# EAGLE design ball_presence_pht (EAGLE 9.6.2)
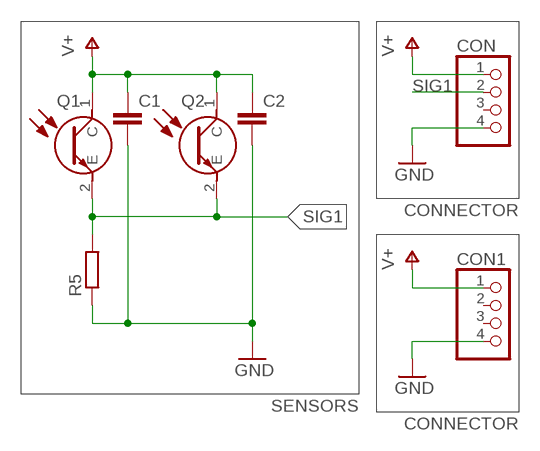
[diagram p0: schematic, sheet 1]

## Parts
C1  C-EUC0805  [C0805]
C2  C-EUC0805  [C0805]
CON  PINHD-1X4  [1X04]
CON1  PINHD-1X4  [1X04]
Q1  VEMT2520X01  [VEMT2520X01]
Q2  VEMT2520X01  [VEMT2520X01]
R5  R-EU_R0805  [R0805]

## Nets
GND: C1.2 C2.2 CON1.4 CON.4 R5.1
SIG1: CON.2 Q1.2(E) Q2.2(E) R5.2
V+: C1.1 C2.1 CON1.1 CON.1 Q1.1(C) Q2.1(C)
Unconnected: CON1.2 CON1.3 CON.3

## Notes on the sheet
- CONNECTOR
- SENSORS
- CONNECTOR

## Library data of the parts
C1 C2 = rcl:C-EU: CAPACITOR, European symbol; SPICEPREFIX: C
CON CON1 = pinhead:PINHD-1X4: PIN HEADER
Q1 Q2 = Fototransistor:VEMT2520X01: Vishay VEMT2520X01 +/-15 IR + Visible Light Phototransistor, Surface Mount 2-Pin Reverse Gullwing Package Source: Datasheet <https://www.vishay.com/docs/81134/vemt2500.pdf>; DESCRIPTION: Vishay VEMT2520X01 +/-15 IR + Visible Light Phototransistor, Surface Mount 2-Pin Reverse Gullwing Package; HEIGHT: 2mm; MANUFACTURER_NAME: Vishay; MANUFACTURER_PART_NUMBER: VEMT2520X01; MOUSER_PART_NUMBER: 782-VEMT2520X01; MOUSER_PRICE-STOCK: https://www.mouser.com/Search/Refine.aspx?Keyword=782-VEMT2520X01; RS_PART_NUMBER: 7689417P; RS_PRICE-STOCK: http://uk.rs-online.com/web/p/products/7689417P
R5 = rcl:R-EU_: RESISTOR, European symbol; SPICEPREFIX: R

## Board
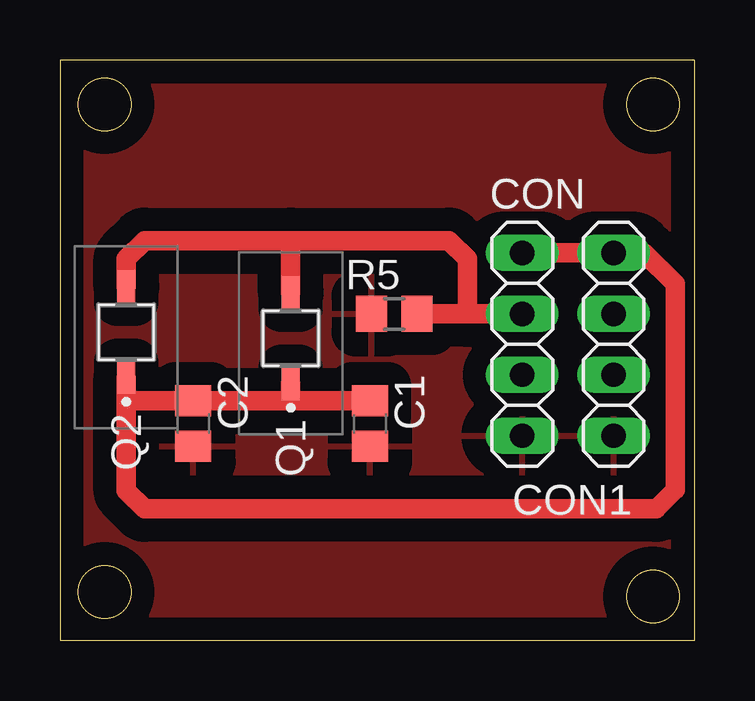
[diagram p1: board, top side]

Size 26.45 x 24.19 mm. Coordinates in mm from the lower left corner, seen from the top.
Outline: 0,24.19 0,0 26.45,0 26.45,24.19 0,24.19
Outline: circle at 24.72,22.35 radius 1.1
Outline: circle at 24.72,1.84 radius 1.1
Outline: circle at 1.86,22.35 radius 1.1
Outline: circle at 1.86,2.03 radius 1.1
Copper layers (1*16): Top 0.035559375mm / dielectric 1.6mm / Bottom 0.035559375mm
Design rules "jlcpcb2layer *": minimum track width 5mil, minimum drill 12mil, track to track 5mil, track to pad 5mil, pad to pad 5mil, via to via 5mil, smd to smd 5mil, copper to edge 8mil, drill to drill 6mil, minimum pad ring 5mil, minimum via ring 3mil, stop-mask expansion 2.5mil, vias tented up to drill 0mil, thermal gap 40mil

### Footprints (pad centres in the part's own frame; a part is rotated, then mirrored left to right if it is on the bottom)
C0805 = smd 1.3 x 1.5: 1 -0.95,0; 2 0.95,0
1X04 = drill 1.016 long: 1 -3.81,0; 2 -1.27,0; 3 1.27,0; 4 3.81,0
VEMT2520X01 = smd 1.35 x 0.75: 1 -1.9,0; 2 1.9,0
R0805 = smd 1.3 x 1.5: 1 -0.95,0; 2 0.95,0

### Placement (x,y rotation side)
C1  12.92,9.04 270 top
C2  5.56,9.04 270 top
CON  19.27,12.35 270 top
CON1  23.08,12.35 270 top
Q1  9.62,12.6 90 top
Q2  2.76,12.85 90 top
R5  13.94,13.62 0 top

### Tracks (layer width: path | path; a pad name or v marks a point on that pad's centre or on a via)
GND
  pour Top (isolate 0.965): -0.54,24.79 -0.54,-0.61 26.89,-0.61 26.89,24.79
SIG1
  Top 0.813: Q2.2 2.76,15.9 3.53,16.66 9.62,16.66 | 9.62,16.66 16.23,16.66 16.99,15.9 16.99,13.62 | CON.2 16.99,13.62 | 16.99,13.62 R5.2 | Q1.2 9.62,16.66
V+
  Top 0.813: CON.1 CON1.1 24.35,16.16 25.65,14.86 25.65,6.27 24.86,5.49 3.53,5.49 2.76,6.25 2.76,10.06 | 12.86,10.06 C1.1 9.62,9.99 | 5.62,10.06 C2.1 | 2.76,10.06 Q2.1 | C2.1 2.83,9.99 2.76,10.06 | C2.1 9.62,9.99 | Q1.1 9.62,9.99